# Altium schematic sheet PLD_Photodiodes.SchDoc: Photodiodes
size A3; SheetTotal: 32
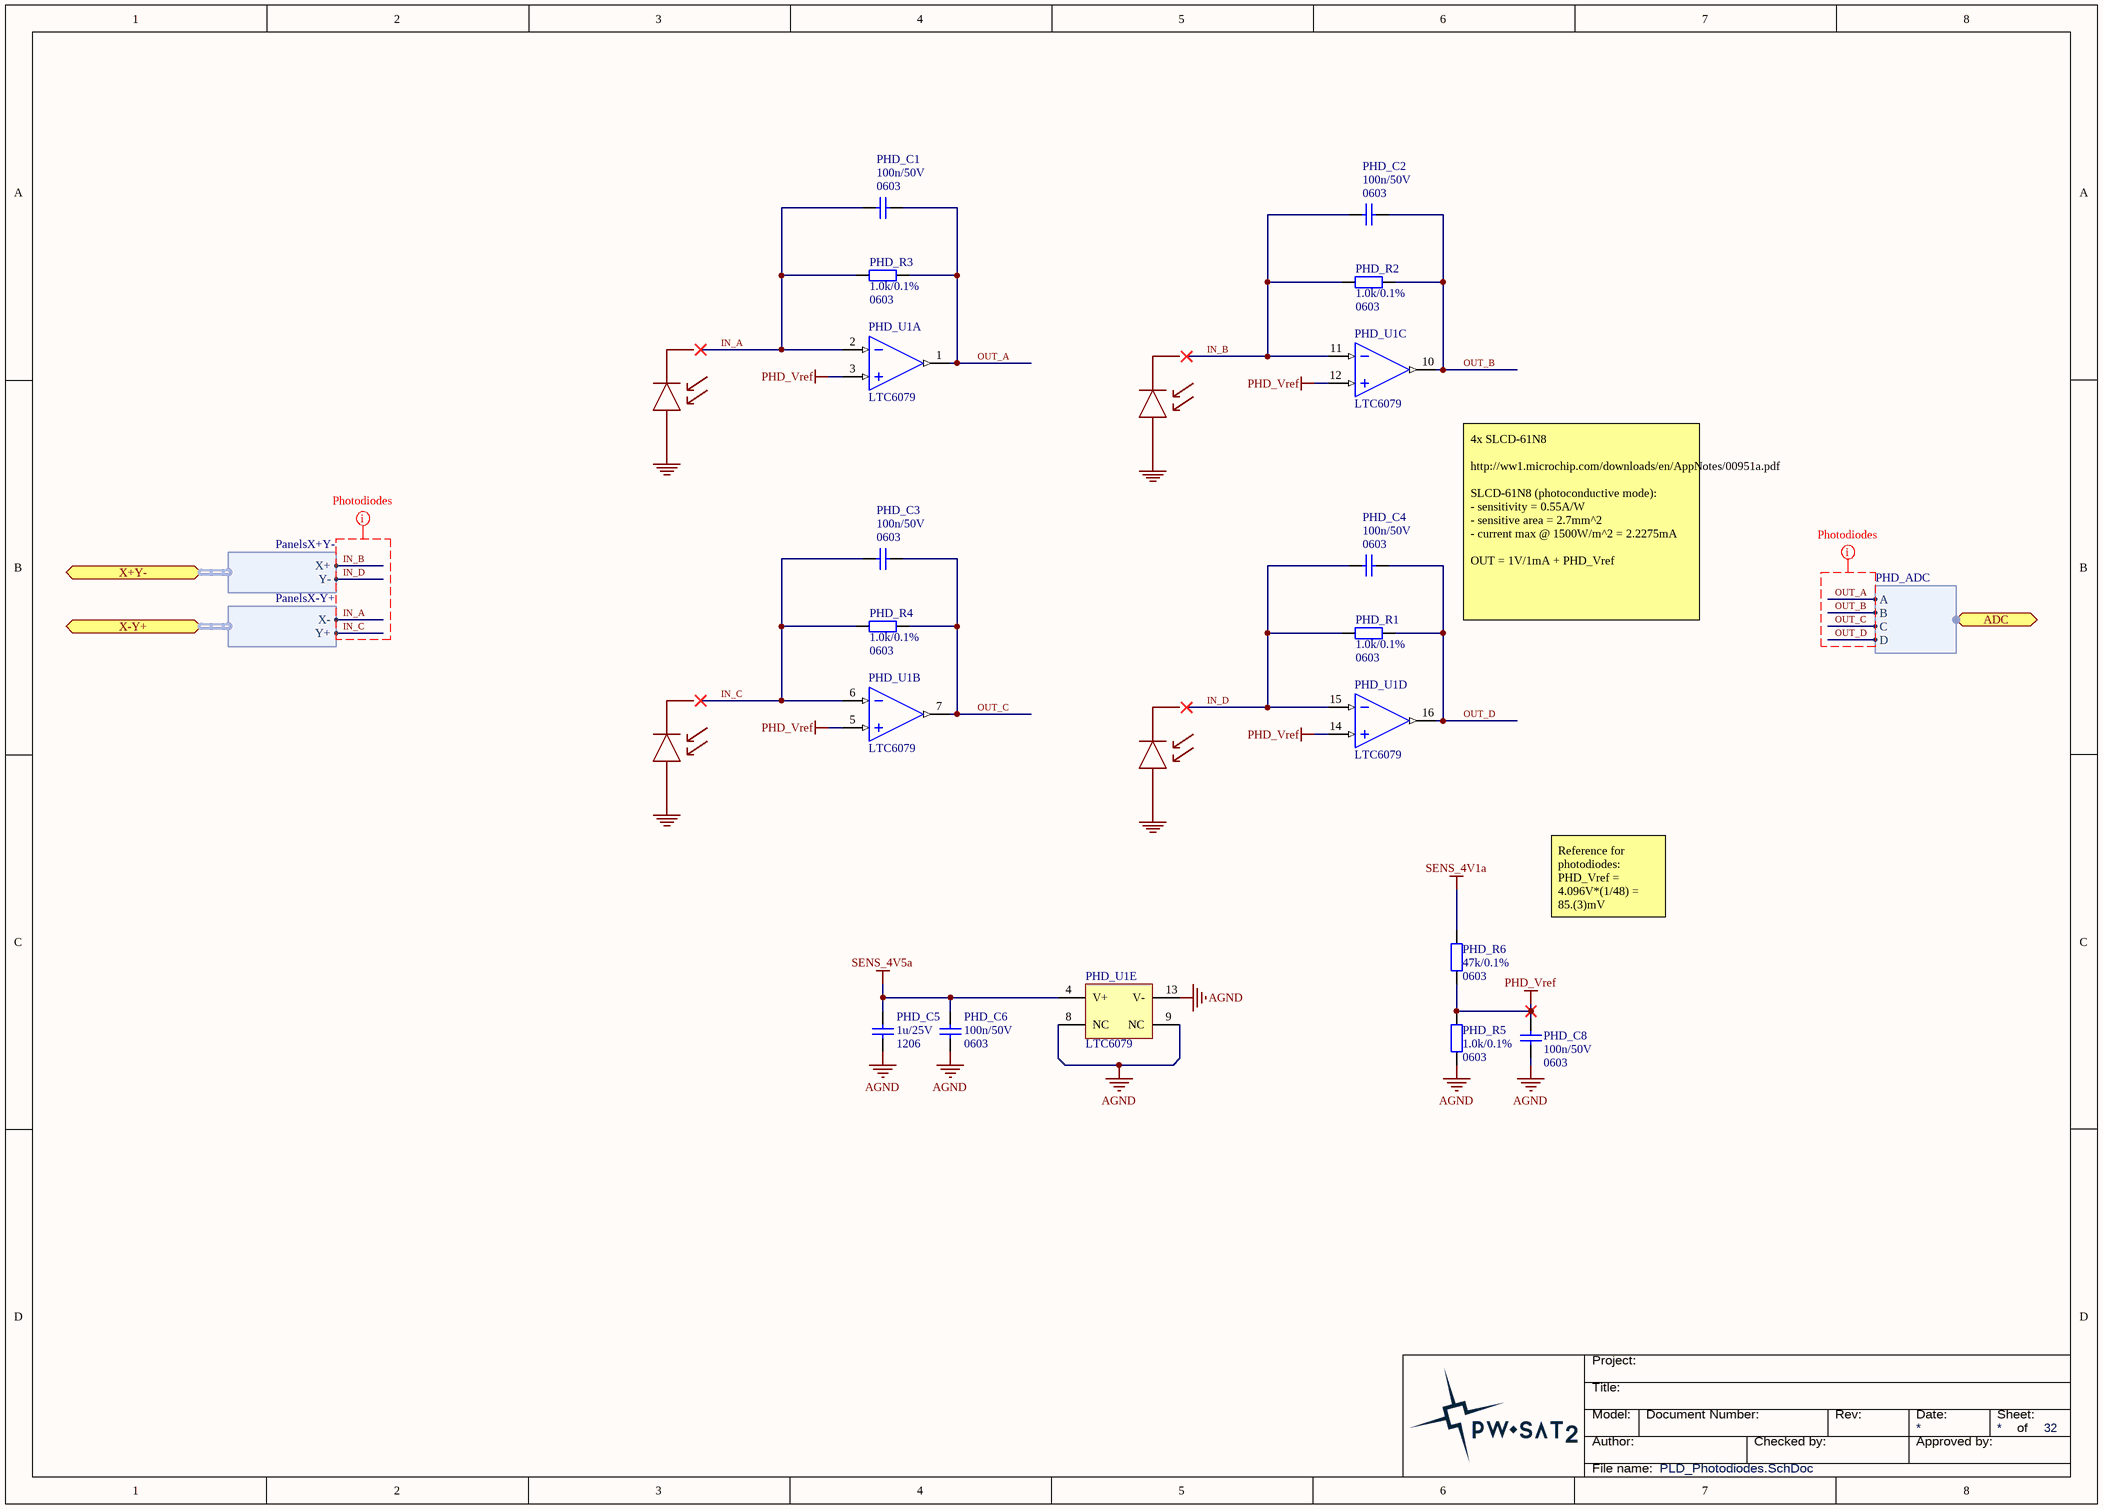
[diagram p0: PLD_Photodiodes.SchDoc]

## Parts
PHD_C1  Package: 0603  [SMD_Capacitor_0603]  (hidden comment: 100n/50V)
PHD_C2  Package: 0603  [SMD_Capacitor_0603]  (hidden comment: 100n/50V)
PHD_C3  Package: 0603  [SMD_Capacitor_0603]  (hidden comment: 100n/50V)
PHD_C4  Package: 0603  [SMD_Capacitor_0603]  (hidden comment: 100n/50V)
PHD_C5  Package: 1206  [SMD_Capacitor_1206]  (hidden comment: 1u/25V)
PHD_C6  Package: 0603  [SMD_Capacitor_0603]  (hidden comment: 100n/50V)
PHD_C8  Package: 0603  [SMD_Capacitor_0603]  (hidden comment: 100n/50V)
PHD_R1  Package: 0603  [SMD_Resistor_0603]  (hidden comment: 1.0k/0.1%)
PHD_R2  Package: 0603  [SMD_Resistor_0603]  (hidden comment: 1.0k/0.1%)
PHD_R3  Package: 0603  [SMD_Resistor_0603]  (hidden comment: 1.0k/0.1%)
PHD_R4  Package: 0603  [SMD_Resistor_0603]  (hidden comment: 1.0k/0.1%)
PHD_R5  Package: 0603  [SMD_Resistor_0603]  (hidden comment: 1.0k/0.1%)
PHD_R6  Package: 0603  [SMD_Resistor_0603]  (hidden comment: 47k/0.1%)
PHD_U1  LTC6079  [SSOP-16]  (parts A,B,C,D,E of 5)

## Ports
ADC (harness PHD_ADC), X+Y- (harness PanelsX+Y-), X-Y+ (harness PanelsX-Y+)

## Harnesses
PanelsX+Y-: X+, Y-
PanelsX-Y+: X-, Y+
PHD_ADC: A, B, C, D

## Nets
AGND: PHD_C5.2 PHD_C6.1 PHD_C8.2 PHD_R5.2 PHD_U1.8(NC) PHD_U1.9(NC) PHD_U1.13(V-)
PHD_Vref: PHD_C8.1 PHD_R5.1 PHD_R6.2 PHD_U1.3(IN+_A) PHD_U1.5(IN+_B) PHD_U1.12(IN+_C) PHD_U1.14(IN+_D)
SENS_4V1a: PHD_R6.1
SENS_4V5a: PHD_C5.1 PHD_C6.2 PHD_U1.4(V+)
IN_A: PHD_C1.1 PHD_R3.1 PHD_U1.2(IN-_A) ; port X-Y+.X-
IN_B: PHD_C2.1 PHD_R2.1 PHD_U1.11(IN-_C) ; port X+Y-.X+
IN_C: PHD_C3.1 PHD_R4.1 PHD_U1.6(IN-_B) ; port X-Y+.Y+
IN_D: PHD_C4.1 PHD_R1.1 PHD_U1.15(IN-_D) ; port X+Y-.Y-
OUT_A: PHD_C1.2 PHD_R3.2 PHD_U1.1(OUT_A) ; port ADC.A
OUT_B: PHD_C2.2 PHD_R2.2 PHD_U1.10(OUT_C) ; port ADC.B
OUT_C: PHD_C3.2 PHD_R4.2 PHD_U1.7(OUT_B) ; port ADC.C
OUT_D: PHD_C4.2 PHD_R1.2 PHD_U1.16(OUT_D) ; port ADC.D

## Layout directives
net class Photodiodes: IN_A, IN_B, IN_C, IN_D, OUT_A, OUT_B, OUT_C, OUT_D

## Notes on the sheet
- 4x SLCD-61N8
  http://ww1.microchip.com/downloads/en/AppNotes/00951a.pdf
  SLCD-61N8 (photoconductive mode):
  - sensitivity = 0.55A/W
  - sensitive area = 2.7mm^2
  - current max @ 1500W/m^2 = 2.2275mA
  OUT = 1V/1mA + PHD_Vref
- Reference for photodiodes:
  PHD_Vref = 4.096V*(1/48) = 85.(3)mV
- Title:
- Project:
- Author:
- Model:
- Document Number:
- Checked by:
- Rev:
- Date:
- Approved by:
- Sheet:
- of
- File name:

## Library data of the parts
PHD_C1-PHD_C4 PHD_C6 PHD_C8 = Cer_C0603T104K5RALTU: Ceramic Cap Kemet COTS 100n/50V X7R 0603; Manufacturer: Kemet; ManufacturerPartNumber: C0603T104K5RALTU; Value: 100n/50V
PHD_C5 = Cer_C1206T105K3RALTU: Ceramic Cap Kemet COTS 1u/25V X7R 1206; ManufacturerPartNumber: C1206T105K3RALTU; Manufacturer: Kemet; Value: 1u/25V
PHD_R1-PHD_R6 = Res
  PHD_R1-PHD_R5: Value: 1.0k/0.1%
  PHD_R6: Value: 47k/0.1%
PHD_U1 = LTC6079: Rail-to-rail, quad operational amplifier. Library compatible with LTC608X LTC607X op-amps; Manufacturer: Linear Technology; Value: LTC6079